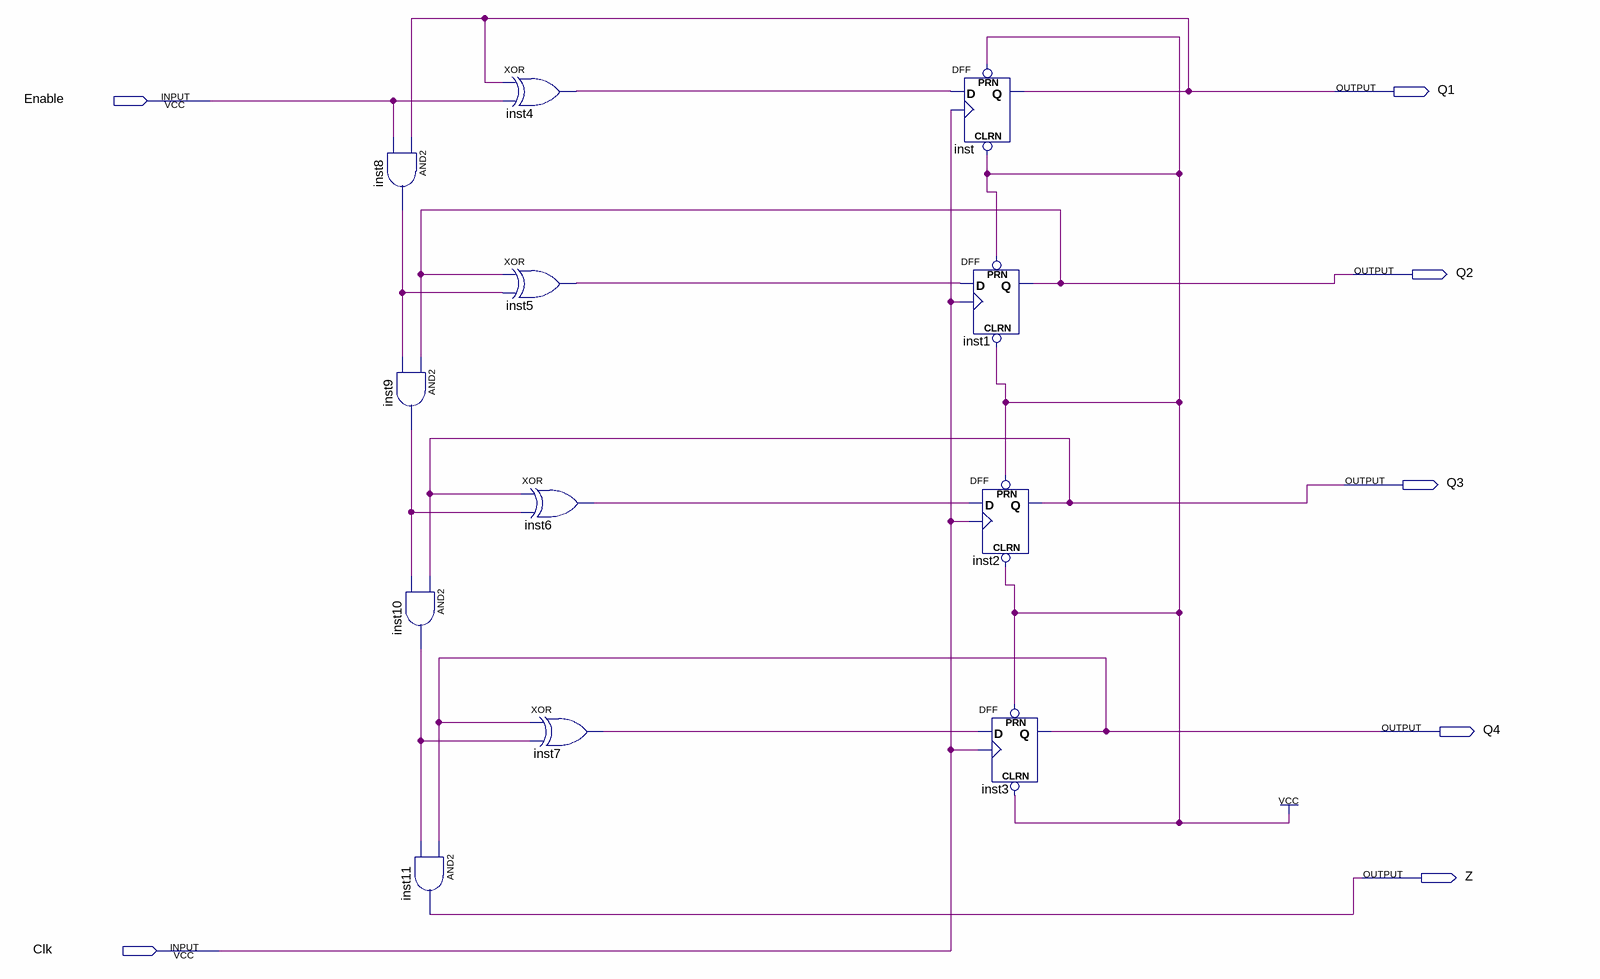
[diagram p0: schematic sheet]
// Quartus schematic lab2step2a.bdf as structural Verilog: 12 symbols, 7 pins
module lab2step2a (
  input  Enable,
  input  Clk,
  output Q1,
  output Q2,
  output Q3,
  output Q4,
  output Z
);

  wire inst4_out, inst5_out, inst6_out, inst7_out, inst8_out, inst9_out, inst10_out;

  and inst8 (inst8_out, Q1, Enable);
  and inst9 (inst9_out, Q2, inst8_out);
  and inst10 (inst10_out, Q3, inst9_out);
  and inst11 (Z, Q4, inst10_out);
  xor inst4 (inst4_out, Q1, Enable);
  xor inst5 (inst5_out, Q2, inst8_out);
  xor inst6 (inst6_out, Q3, inst9_out);
  xor inst7 (inst7_out, Q4, inst10_out);
  DFF inst (.CLRN(1'b1), .CLK(Clk), .D(inst4_out), .PRN(1'b1), .Q(Q1));
  DFF inst1 (.CLRN(1'b1), .CLK(Clk), .D(inst5_out), .PRN(1'b1), .Q(Q2));
  DFF inst2 (.CLRN(1'b1), .CLK(Clk), .D(inst6_out), .PRN(1'b1), .Q(Q3));
  DFF inst3 (.CLRN(1'b1), .CLK(Clk), .D(inst7_out), .PRN(1'b1), .Q(Q4));
endmodule
